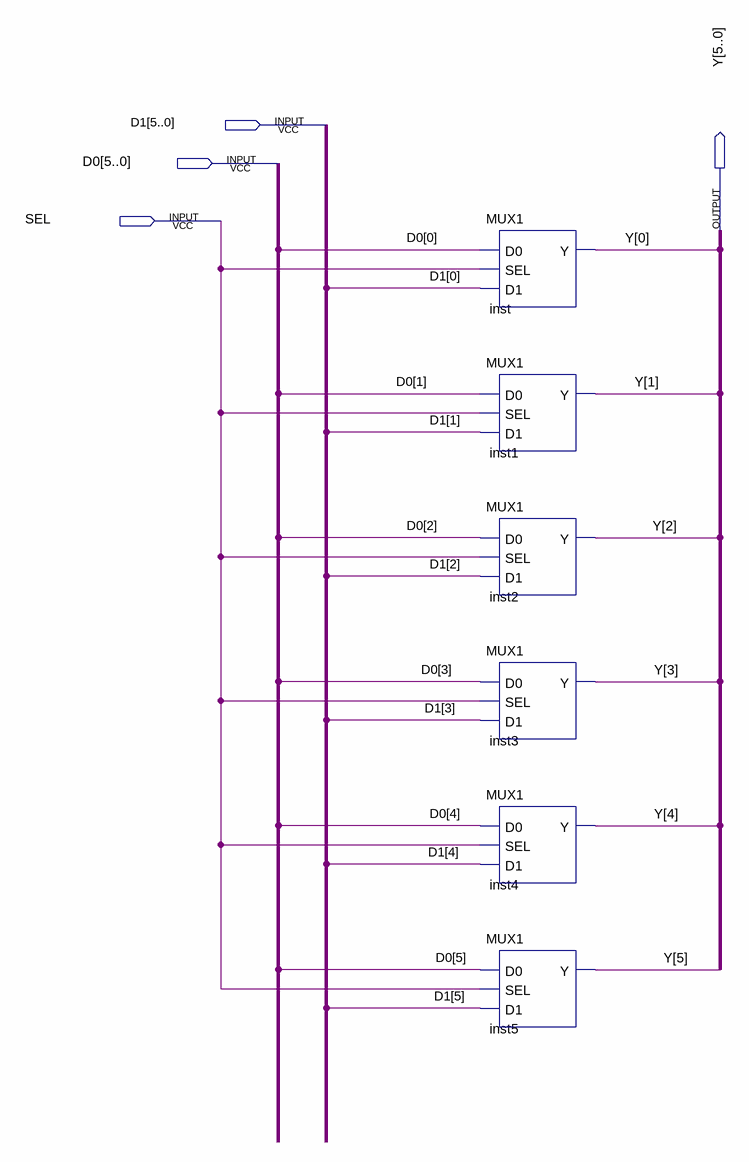
[diagram p0: schematic sheet]
// Quartus schematic MUX2_6.bdf as structural Verilog: 6 symbols, 4 pins
module MUX2_6 (
  input  [5:0] D1,
  input  [5:0] D0,
  input  SEL,
  output [5:0] Y
);

  MUX1 inst (.D0(D0[0]), .SEL(SEL), .D1(D1[0]), .Y(Y[0]));
  MUX1 inst1 (.D0(D0[1]), .SEL(SEL), .D1(D1[1]), .Y(Y[1]));
  MUX1 inst2 (.D0(D0[2]), .SEL(SEL), .D1(D1[2]), .Y(Y[2]));
  MUX1 inst3 (.D0(D0[3]), .SEL(SEL), .D1(D1[3]), .Y(Y[3]));
  MUX1 inst4 (.D0(D0[4]), .SEL(SEL), .D1(D1[4]), .Y(Y[4]));
  MUX1 inst5 (.D0(D0[5]), .SEL(SEL), .D1(D1[5]), .Y(Y[5]));
endmodule
